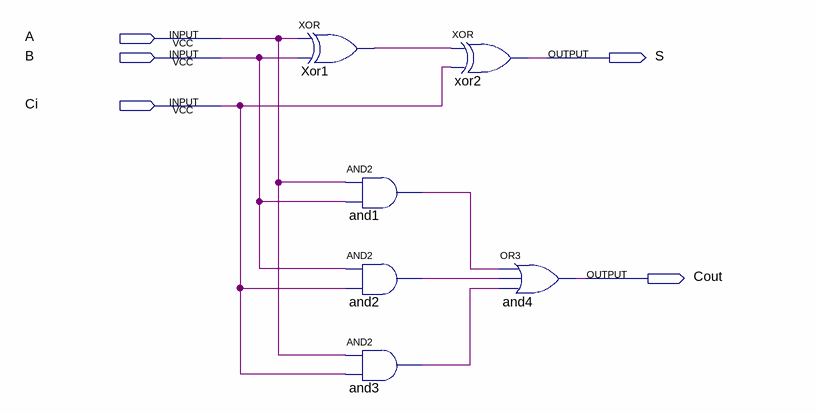
[diagram p0: schematic sheet]
// Quartus schematic FullAdder.bdf as structural Verilog: 6 symbols, 5 pins
module FullAdder (
  input  A,
  input  B,
  input  Ci,
  output S,
  output Cout
);

  wire and1_out, and2_out, and3_out, Xor1_out;

  xor Xor1 (Xor1_out, A, B);
  and and1 (and1_out, A, B);
  and and2 (and2_out, B, Ci);
  and and3 (and3_out, A, Ci);
  xor xor2 (S, Xor1_out, Ci);
  or and4 (Cout, and1_out, and2_out, and3_out);
endmodule
